# EAGLE design 1.0 (EAGLE 7.2.0)
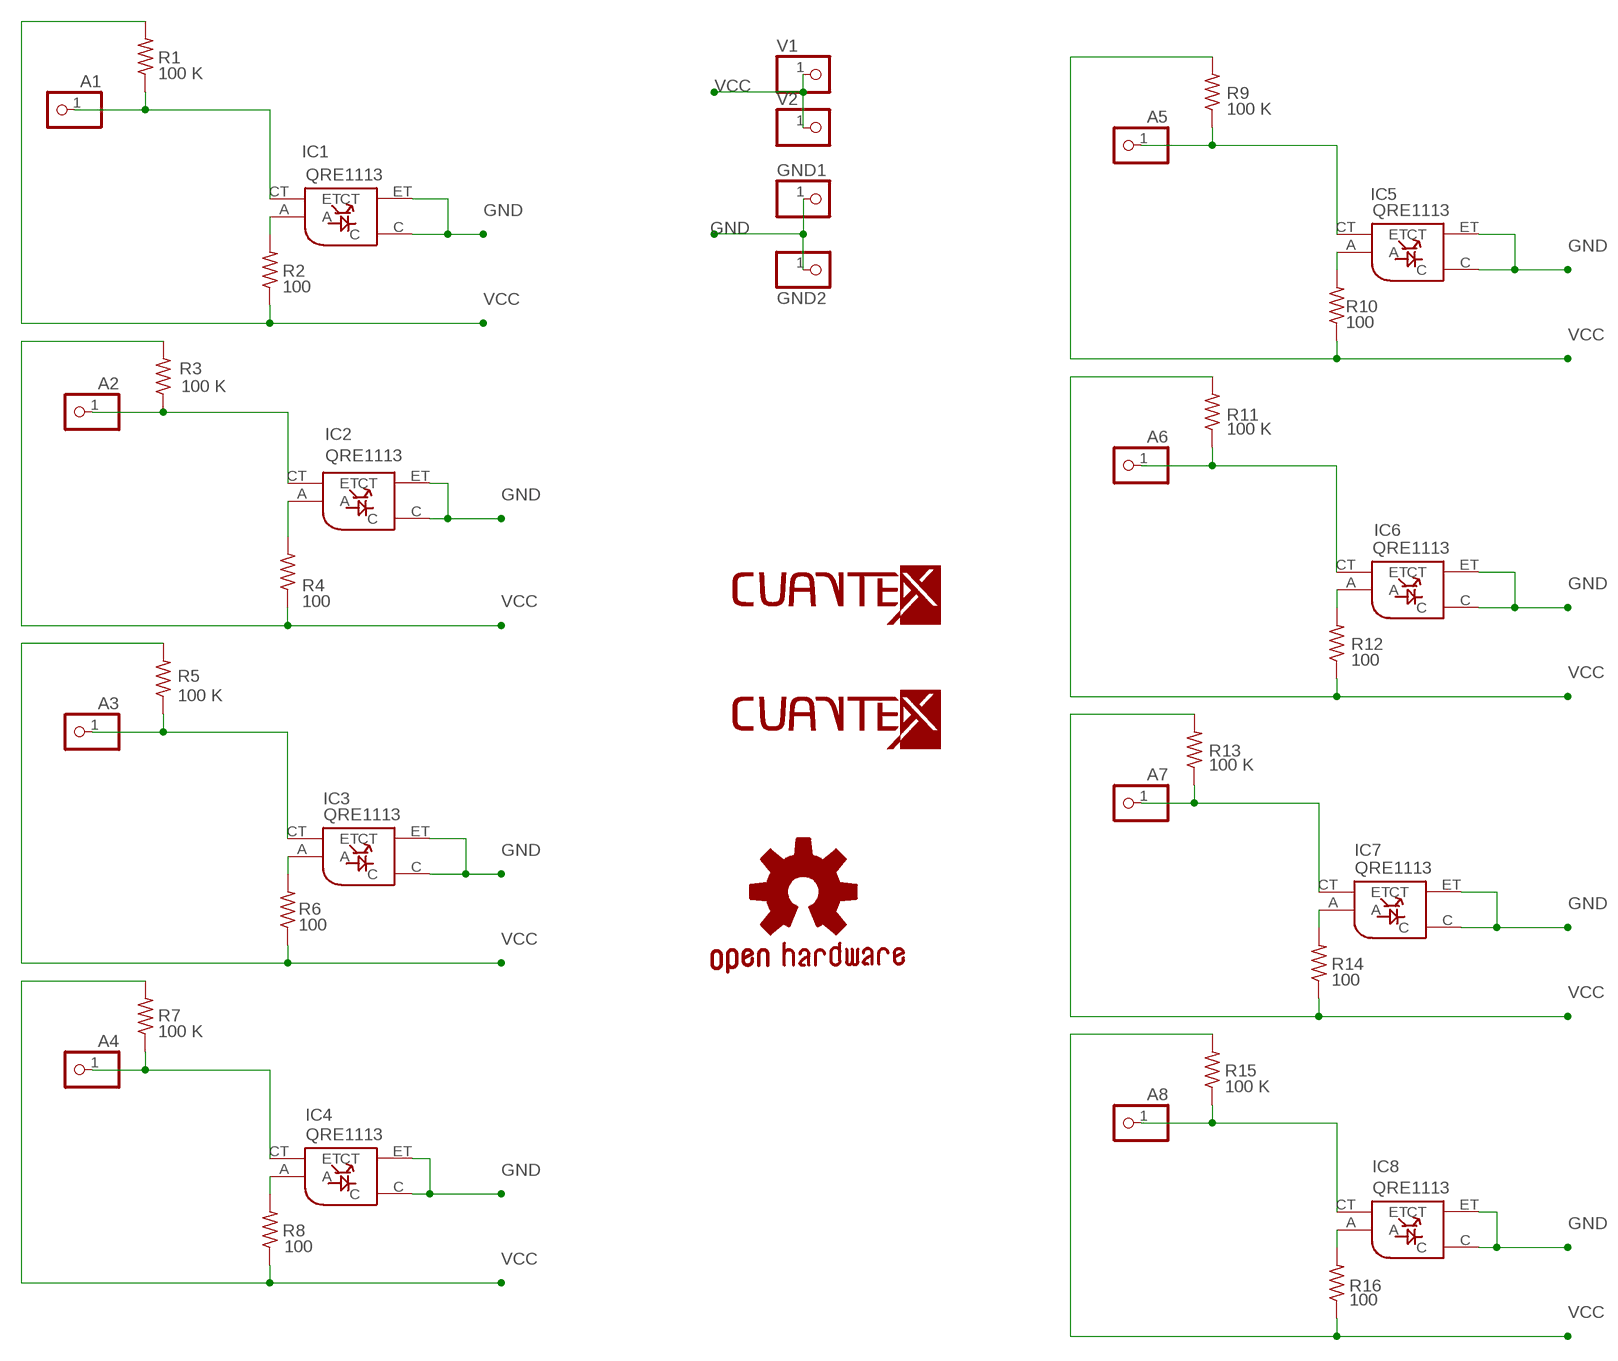
[diagram p0: schematic, sheet 1]

## Parts
A1  PINHD-1X1  [1X01]
A2  PINHD-1X1  [1X01]
A3  PINHD-1X1  [1X01]
A4  PINHD-1X1  [1X01]
A5  PINHD-1X1  [1X01]
A6  PINHD-1X1  [1X01]
A7  PINHD-1X1  [1X01]
A8  PINHD-1X1  [1X01]
GND1  PINHD-1X1  [1X01]
GND2  PINHD-1X1  [1X01]
GOLD_ORB_SM1  OSHWLOGO_GOLD_ORB_SM  [OSHW2]
IC1  QRE1113  [QRE1113]
IC2  QRE1113  [QRE1113]
IC3  QRE1113  [QRE1113]
IC4  QRE1113  [QRE1113]
IC5  QRE1113  [QRE1113]
IC6  QRE1113  [QRE1113]
IC7  QRE1113  [QRE1113]
IC8  QRE1113  [QRE1113]
R1  100 K  R-US_R0603  [R0603]
R2  100  R-US_R0603  [R0603]
R3  100 K  R-US_R0603  [R0603]
R4  100  R-US_R0603  [R0603]
R5  100 K  R-US_R0603  [R0603]
R6  100  R-US_R0603  [R0603]
R7  100 K  R-US_R0603  [R0603]
R8  100  R-US_R0603  [R0603]
R9  100 K  R-US_R0603  [R0603]
R10  100  R-US_R0603  [R0603]
R11  100 K  R-US_R0603  [R0603]
R12  100  R-US_R0603  [R0603]
R13  100 K  R-US_R0603  [R0603]
R14  100  R-US_R0603  [R0603]
R15  100 K  R-US_R0603  [R0603]
R16  100  R-US_R0603  [R0603]
U$1  LOGO-TOP-30MM  [C-1]
U$2  LOGO-TOP-20MM  [C-0]
V1  PINHD-1X1  [1X01]
V2  PINHD-1X1  [1X01]

## Nets
GND: GND1.1 GND2.1 IC1.C IC1.ET(CT) IC2.C IC2.ET(CT) IC3.C IC3.ET(CT) IC4.C IC4.ET(CT) IC5.C IC5.ET(CT) IC6.C IC6.ET(CT) IC7.C IC7.ET(CT) IC8.C IC8.ET(CT)
N$3: IC1.A R2.2
N$7: A1.1 IC1.CT(ET) R1.1
N$13: A2.1 IC2.CT(ET) R3.1
N$14: A5.1 IC5.CT(ET) R9.1
N$16: IC2.A R4.2
N$17: IC5.A R10.2
N$23: A3.1 IC3.CT(ET) R5.1
N$24: IC3.A R6.2
N$25: A6.1 IC6.CT(ET) R11.1
N$28: A4.1 IC4.CT(ET) R7.1
N$31: IC4.A R8.2
N$36: IC6.A R12.2
N$38: A8.1 IC8.CT(ET) R15.1
N$41: IC8.A R16.2
N$44: A7.1 IC7.CT(ET) R13.1
N$47: IC7.A R14.2
VCC: R1.2 R2.1 R3.2 R4.1 R5.2 R6.1 R7.2 R8.1 R9.2 R10.1 R11.2 R12.1 R13.2 R14.1 R15.2 R16.1 V1.1 V2.1

## Library data of the parts
A1-A8 GND1 GND2 V1 V2 = pinhead:PINHD-1X1: PIN HEADER
GOLD_ORB_SM1 = OPENHW:OSHWLOGO: These are Open-Source Hardware logos.
IC1-IC8 = qre1113:QRE1113
R1-R16 = resistor:R-US_: RESISTOR, American symbol
U$1 = LOGOTIPOS:LOGO-TOP-30MM
U$2 = LOGOTIPOS:LOGO-TOP-20MM

## Board
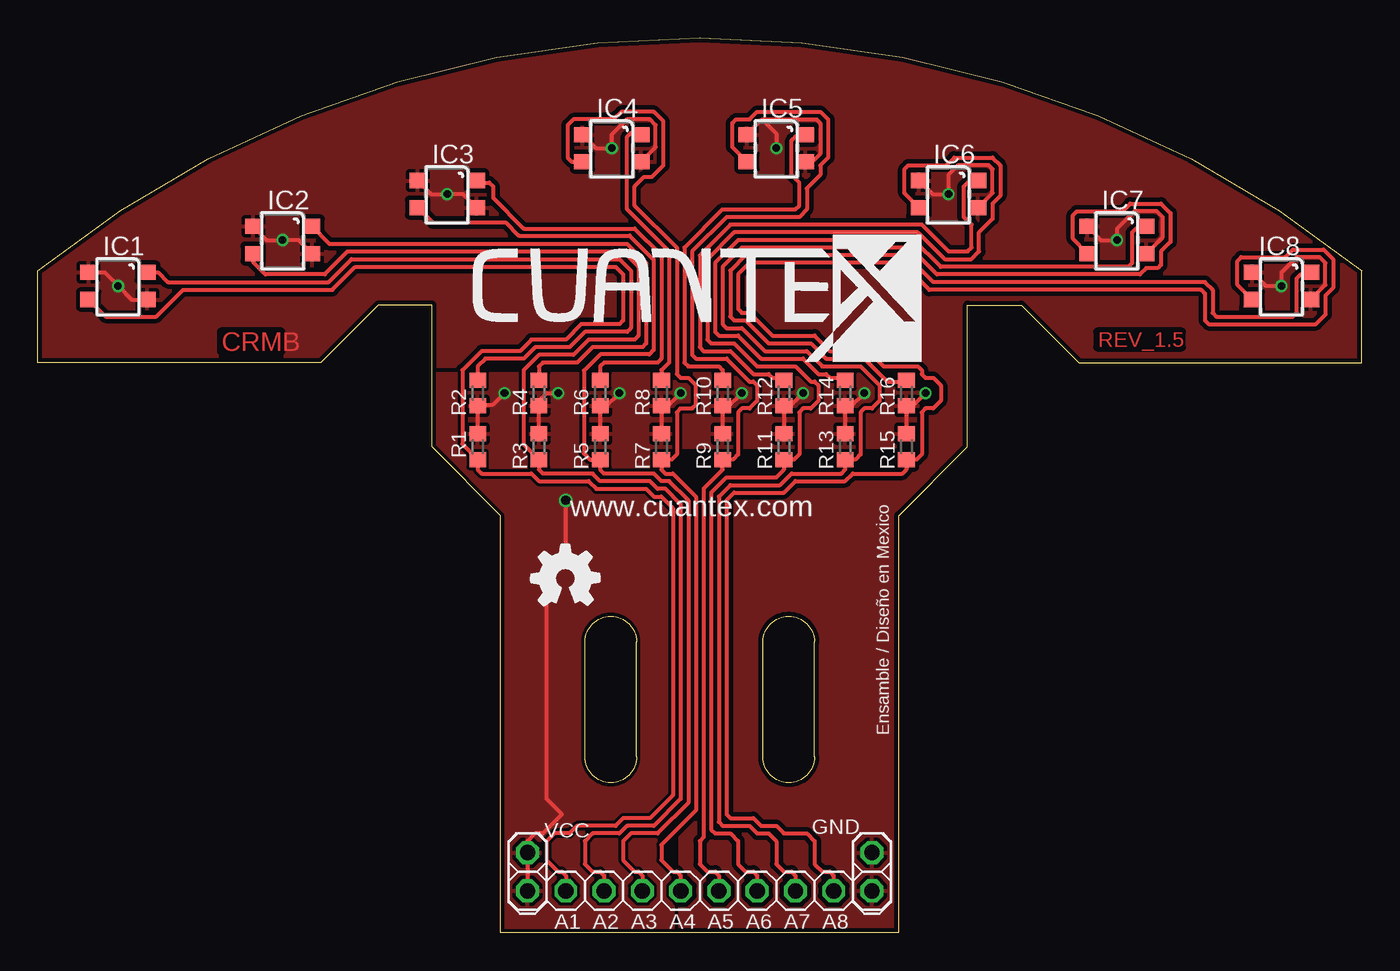
[diagram p1: board, top side]
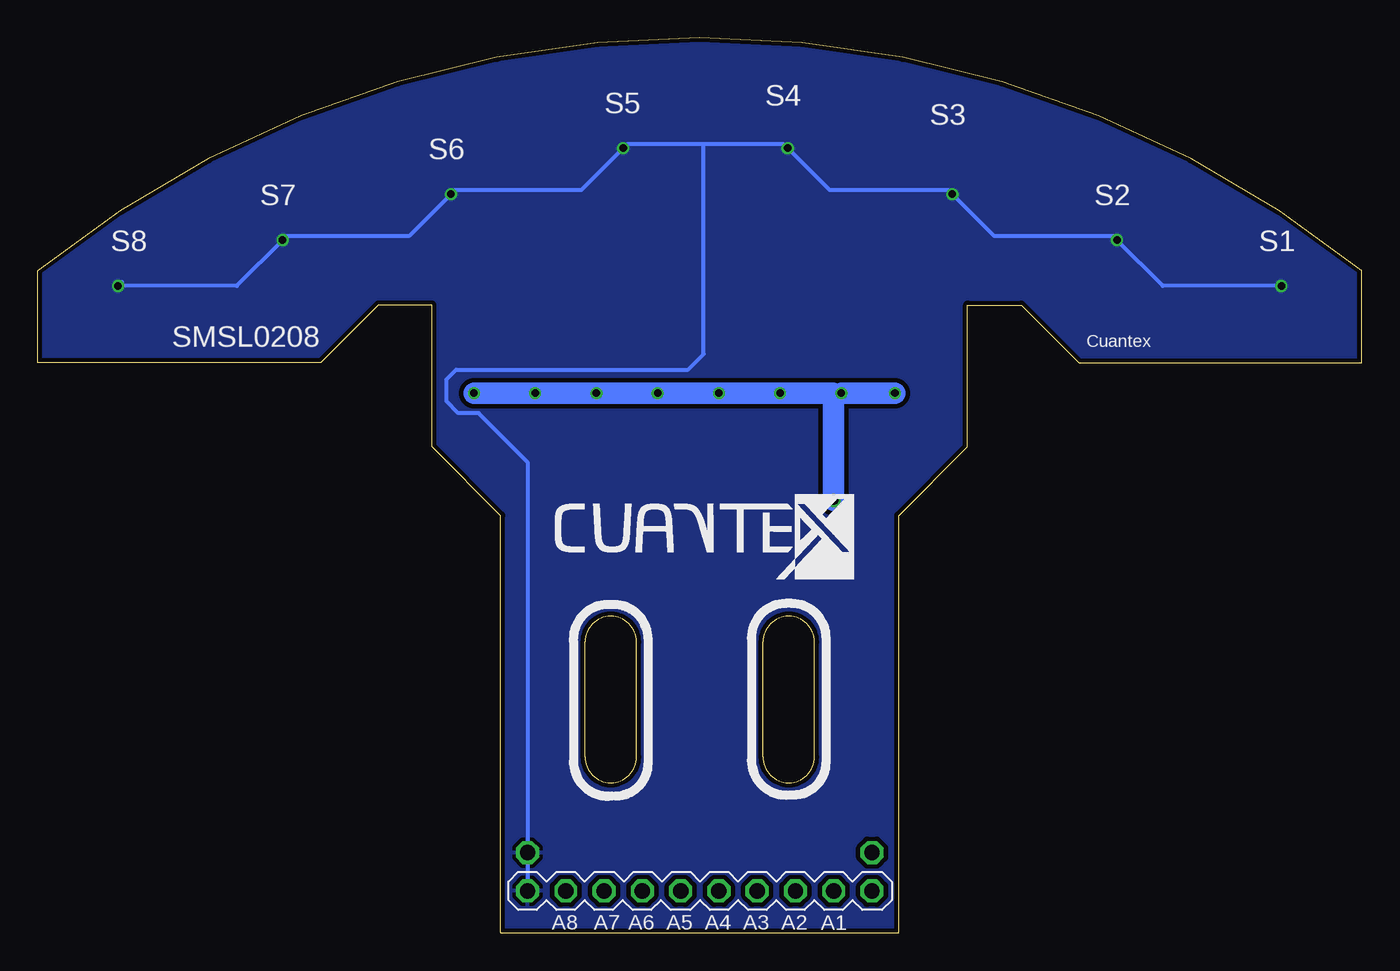
[diagram p2: board, bottom side, seen from below]

Size 87.88 x 59.4 mm. Coordinates in mm from the lower left corner, seen from the top.
Outline: 57.15,0 30.73,0 30.73,27.69 26.16,32.26 26.16,41.66 22.61,41.66 18.8,37.85 0,37.85 0,43.94 arc-78 87.88,43.94 87.88,37.85 69.09,37.85 65.28,41.66 61.72,41.66 61.72,32.26 57.15,27.69 57.15,0
Outline: 36.32,11.68 36.32,19.3 arc-180 39.75,19.3 39.75,11.68 arc-180 36.32,11.68
Outline: 48.13,11.68 48.13,19.3 arc-180 51.56,19.3 51.56,11.68 arc-180 48.13,11.68
Copper layers (1*16): Top 0.035mm / dielectric 1.5mm / Bottom 0.035mm
Design rules "DRC_HeTPpro_08_2014": minimum track width 8mil, minimum drill 12mil, track to track 8mil, track to pad 8mil, pad to pad 8mil, via to via 8mil, smd to smd 0mil, copper to edge 10mil, drill to drill 10mil, minimum pad ring 10mil, minimum via ring 6mil, stop-mask expansion 2mil, vias tented up to drill 100mil, thermal gap 10mil

### Footprints (pad centres in the part's own frame; a part is rotated, then mirrored left to right if it is on the bottom)
1X01 = drill 1.016 octagon: 1 0,0
QRE1113 = smd 1.1 x 1: A 1.95,0.9; C -1.95,0.9; CT -1.95,-0.9; ET 1.95,-0.9
R0603 = smd 1 x 1.1: 1 -0.85,0; 2 0.85,0

### Placement (x,y rotation side)
A1  35.05,2.79 0 top
A2  37.59,2.79 0 top
A3  40.13,2.79 0 top
A4  42.67,2.79 0 top
A5  45.21,2.79 0 top
A6  47.75,2.79 0 top
A7  50.29,2.79 0 top
A8  52.83,2.79 0 top
GND1  55.37,5.33 0 top
GND2  55.37,2.79 0 top
GOLD_ORB_SM1  31.2,19.24 0 top
IC1  5.33,42.93 0 top
IC2  16.26,45.97 0 top
IC3  27.18,49.02 0 top
IC4  38.1,52.07 0 top
IC5  49.02,52.07 0 top
IC6  60.45,49.02 0 top
IC7  71.63,45.97 0 top
IC8  82.55,42.93 0 top
R1  29.21,32.26 90 top
R2  29.21,35.81 90 top
R3  33.27,32.26 90 top
R4  33.27,35.81 90 top
R5  37.34,32.26 90 top
R6  37.34,35.81 90 top
R7  41.4,32.26 90 top
R8  41.4,35.81 90 top
R9  45.47,32.26 90 top
R10  45.47,35.81 90 top
R11  49.53,32.26 90 top
R12  49.53,35.81 90 top
R13  53.59,32.26 90 top
R14  53.59,35.81 90 top
R15  57.66,32.26 90 top
R16  57.66,35.81 90 top
U$1  28.81,37.81 0 top
U$2  53.6,23.43 0 bottom
V1  32.51,5.33 0 top
V2  32.51,2.79 0 top

### Tracks (layer width: path | path; a pad name or v marks a point on that pad's centre or on a via)
GND  (via drill 0.5)
  Top 0.254: 3.27,43.94 IC1.C 4.43,43.83 v5.33,42.93 6.23,42.03 IC1.ET | IC2.C 15.21,45.97 v16.26,45.97 17.31,45.97 IC2.ET | IC3.C 26.13,49.02 v27.18,49.02 28.23,49.02 IC3.ET | IC4.C 37.05,52.07 v38.1,52.07 38.1,52.96 39.12,53.97 40.64,53.97 41.02,53.59 41.02,52.14 IC4.ET | IC5.C 48.08,53.97 | 48.08,53.97 51.69,53.97 51.94,53.72 51.94,51.69 51.42,51.17 IC5.ET | 48.08,53.97 49.02,53.03 v49.02,52.07 | IC6.C 59.4,49.02 v60.45,49.02 60.45,50.29 61.09,50.93 63.12,50.93 63.37,50.67 63.37,49.09 IC6.ET | IC7.C 70.58,45.97 v71.63,45.97 71.63,46.74 72.77,47.88 74.3,47.88 74.68,47.5 74.68,46.17 IC7.ET | IC8.C 81.5,42.93 v82.55,42.93 82.55,43.81 83.57,44.83 85.09,44.83 85.47,44.45 85.47,43 IC8.ET
  Bottom 0.254: 82.3,43.18 v82.55,42.93 74.68,42.93 v71.63,45.97 71.37,46.23 63.25,46.23 v60.45,49.02 60.2,49.28 51.82,49.28 v49.02,52.07 48.77,52.32 43.69,52.32 | v5.33,42.93 13.21,42.93 v16.26,45.97 16.51,46.23 24.38,46.23 v27.18,49.02 27.43,49.28 35.31,49.28 v38.1,52.07 38.35,52.32 43.69,52.32 | 43.69,52.32 43.69,38.41 44.71,37.38 60.11,37.38 60.76,36.73 60.76,35.28 59.97,34.49 58.62,34.49 55.37,31.24 GND1.1 GND2.1
  pour Top (isolate 0.305): 42.67,0 42.67,31.75 57.15,31.75 58.93,33.53 58.93,36.32 57.66,37.59 26.16,37.59 26.16,41.66 22.61,41.66 18.8,37.85 0,37.85 0,43.94 2.03,45.47 4.57,47.24 7.62,49.28 11.68,51.56 15.49,53.34 19.3,54.86 22.86,56.13 26.42,57.15 29.72,57.91 32.51,58.42 35.81,58.93 38.86,59.18 43.43,59.44 50.04,59.18 55.63,58.42 60.45,57.4 63.5,56.64 67.31,55.37 70.36,54.1 73.66,52.83 76.96,51.05 79.25,49.78 81.03,48.77 85.6,45.72 87.88,43.94 87.88,37.85 69.09,37.85 65.28,41.66 61.72,41.66 61.72,32.26 57.15,27.69 57.15,0
  pour Bottom (isolate 0.305): 30.76,0.01 57.15,0.01 57.15,27.69 61.7,32.25 61.7,41.64 65.24,41.64 69.07,37.81 87.86,37.81 87.86,43.96 84.9,46.2 81.29,48.73 77.82,50.68 74.35,52.41 69.94,54.44 65.82,55.88 60.54,57.4 57.29,58.12 52.3,58.92 49.2,59.21 46.67,59.35 43.27,59.42 38.35,59.21 35.17,58.85 32.21,58.41 28.81,57.76 25.2,56.89 22.81,56.1 20.72,55.45 18.62,54.65 15.59,53.42 12.77,52.05 9.44,50.39 7.42,49.16 4.82,47.5 1.93,45.4 0.26,44.17 -0.02,43.88 -0.02,37.89 18.84,37.89 22.6,41.64 26.14,41.64 26.14,32.25 30.76,27.62
N$3
  Top 0.254: IC1.A 7.99,43.83 8.64,43.18 19.3,43.18 20.83,44.7 38.61,44.7 39.37,43.94 39.37,40.13 39.12,39.88 36.32,39.88 35.31,38.86 33.02,38.86 32.26,38.1 29.72,38.1 29.21,37.59 R2.2
N$7
  Top 0.254: A1.1 35.05,3.81 34.8,4.06 34.54,4.06 33.78,4.83 33.78,6.1 34.29,6.6 35.31,6.6 35.81,7.11 38.35,7.11 38.86,7.62 40.64,7.62 42.16,9.14 42.16,28.19 41.4,28.96 40.89,28.96 40.39,29.46 37.08,29.46 36.58,29.97 33.27,29.97 32.77,30.48 29.46,30.48 29.21,30.73 R1.1 28.19,32.42 28.19,37.34 29.46,38.61 32,38.61 32.77,39.37 35.05,39.37 36.07,40.39 38.61,40.39 38.86,40.64 38.86,43.69 38.35,44.2 21.08,44.2 19.56,42.67 9.65,42.67 7.87,40.89 4.52,40.89 IC1.CT
N$13
  Top 0.254: A2.1 37.59,3.81 37.34,4.06 36.83,4.06 36.32,4.57 36.32,6.1 36.83,6.6 38.61,6.6 39.12,7.11 40.89,7.11 42.67,8.89 42.67,28.45 41.66,29.46 41.15,29.46 40.64,29.97 37.34,29.97 36.83,30.48 33.53,30.48 33.27,30.73 R3.1 32.26,32.42 32.26,37.34 33.27,38.35 35.56,38.35 36.58,39.37 39.62,39.37 39.88,39.62 39.88,44.2 38.86,45.21 20.57,45.21 19.05,43.69 15.11,43.69 14.31,44.49 IC2.CT
N$14
  Top 0.254: A5.1 45.21,3.81 44.96,4.06 44.45,4.06 43.94,4.57 43.94,6.1 44.2,6.35 44.2,29.46 45.47,30.73 R9.1 46.14,31.41 46.48,31.75 46.48,34.54 46.74,34.8 47.24,34.8 47.75,35.31 47.75,36.32 47.5,36.58 47.24,36.58 45.72,38.1 43.69,38.1 43.43,38.35 43.43,45.21 45.72,47.5 50.55,47.5 51.05,48.01 51.05,49.4 51.94,50.29 51.94,50.93 52.45,51.43 52.45,53.97 51.94,54.48 47.75,54.48 47.24,53.97 46.36,53.97 46.1,53.72 46.1,52.14 IC5.CT
N$16
  Top 0.254: R4.2 33.27,37.59 33.53,37.85 35.81,37.85 36.83,38.86 40.13,38.86 40.39,39.12 40.39,44.45 39.12,45.72 19.36,45.72 IC2.A
N$17
  Top 0.254: R10.2 45.47,37.34 45.21,37.59 43.18,37.59 42.93,37.85 42.93,45.47 45.47,48.01 50.29,48.01 50.55,48.26 50.55,49.78 50.04,50.29 50.04,52.58 50.29,52.83 50.83,52.83 IC5.A
N$23
  Top 0.254: A3.1 40.13,3.81 39.88,4.06 39.62,4.06 38.86,4.83 38.86,6.1 39.37,6.6 41.15,6.6 43.18,8.64 43.18,28.7 41.91,29.97 41.4,29.97 40.89,30.48 37.59,30.48 37.34,30.73 R5.1 36.66,31.41 36.26,31.81 36.26,37.31 37.34,38.39 40.6,38.39 40.88,38.68 40.88,44.68 39.29,46.27 31.92,46.27 31.05,47.14 26.21,47.14 IC3.CT
N$24
  Top 0.254: IC3.A 29.13,49.87 29.21,49.78 29.97,49.78 30.23,49.53 30.23,48.77 32.26,46.74 39.62,46.74 41.4,44.96 41.4,38.1 41.15,37.85 37.59,37.85 37.34,37.59 R6.2
N$25
  Top 0.254: IC6.CT 57.53,49.09 57.53,50.67 57.79,50.93 60.33,50.93 60.83,51.43 63.37,51.43 63.88,50.93 63.88,48.89 63.37,48.39 63.37,47.37 62.48,46.48 62.48,45.21 61.98,44.7 60.2,44.7 58.42,46.48 46.23,46.48 44.45,44.7 44.45,39.37 44.7,39.12 46.23,39.12 47.75,37.59 50.29,37.59 51.31,36.58 51.56,36.58 51.82,36.32 51.82,35.31 51.31,34.8 50.8,34.8 50.55,34.54 50.55,31.75 50.2,31.41 R11.1 49.53,30.73 49.02,30.23 45.72,30.23 44.7,29.21 44.7,6.86 44.96,6.6 45.97,6.6 46.48,6.1 46.48,4.57 46.99,4.06 47.5,4.06 47.75,3.81 A6.1
N$28
  Top 0.254: IC4.CT 35.44,51.17 35.18,51.43 35.18,53.59 35.56,53.97 38.23,53.97 38.74,54.48 40.89,54.48 41.53,53.85 41.53,50.93 40.77,50.16 40.26,50.16 39.62,49.53 39.62,48.26 42.42,45.47 42.42,37.08 42.67,36.83 43.18,36.83 43.69,36.32 43.69,35.05 43.43,34.8 42.67,34.8 42.42,34.54 42.42,31.75 42.08,31.41 R7.1 41.4,30.73 41.66,30.48 42.16,30.48 43.69,28.96 43.69,8.13 41.4,5.84 41.4,4.83 42.16,4.06 42.42,4.06 42.67,3.81 A4.1
N$31
  Top 0.254: R8.2 41.4,37.34 41.91,37.85 41.91,45.21 39.12,48.01 39.12,52.83 39.37,53.09 39.93,53.09 IC4.A
N$36
  Top 0.254: IC6.A 62.26,49.78 61.72,49.78 61.47,49.53 61.47,47.5 61.98,46.99 61.98,45.47 61.72,45.21 60.45,45.21 58.67,46.99 45.97,46.99 43.94,44.96 43.94,38.86 44.2,38.61 45.97,38.61 47.5,37.08 48.51,37.08 48.77,36.83 49.36,36.83 R12.2
N$38
  Top 0.254: IC8.CT 79.63,43 79.63,44.58 79.88,44.83 82.8,44.83 83.31,45.34 85.34,45.34 85.98,44.7 85.98,42.8 85.47,42.29 85.47,41.02 84.84,40.39 77.72,40.39 77.47,40.64 77.47,42.42 77.22,42.67 59.18,42.67 57.4,44.45 47.24,44.45 46.48,43.69 46.48,41.4 46.74,41.15 47.24,41.15 48.77,39.62 51.56,39.62 52.58,38.61 55.12,38.61 56.13,37.59 58.42,37.59 58.67,37.34 58.67,37.08 58.93,36.83 59.44,36.83 59.94,36.32 59.94,35.31 59.44,34.8 58.93,34.8 58.67,34.54 58.67,31.75 58.33,31.41 R15.1 57.66,30.73 57.4,30.48 54.1,30.48 53.59,29.97 50.29,29.97 49.53,29.21 46.23,29.21 45.72,28.7 45.72,7.87 45.97,7.62 47.5,7.62 48.01,7.11 49.02,7.11 49.53,6.6 51.05,6.6 51.56,6.1 51.56,4.57 52.07,4.06 52.58,4.06 52.83,3.81 A8.1
N$41
  Top 0.254: IC8.A 84.36,43.69 83.82,43.69 83.57,43.43 83.57,41.15 83.31,40.89 78.23,40.89 77.98,41.15 77.98,42.67 77.47,43.18 59.44,43.18 57.66,44.96 46.99,44.96 45.97,43.94 45.97,40.89 46.23,40.64 46.99,40.64 48.51,39.12 51.31,39.12 52.32,38.1 54.86,38.1 56.39,36.58 57.57,36.58 R16.2
N$44
  Top 0.254: IC7.CT 68.71,46.04 68.71,47.62 68.96,47.88 72.01,47.88 72.52,48.39 74.55,48.39 75.18,47.75 75.18,45.85 74.55,45.21 74.55,44.32 74.34,44.11 73.58,44.11 73.15,43.69 59.69,43.69 57.91,45.47 46.74,45.47 45.47,44.2 45.47,40.39 45.72,40.13 46.74,40.13 48.26,38.61 51.05,38.61 52.07,37.59 54.61,37.59 55.88,36.32 55.88,35.31 55.37,34.8 54.86,34.8 54.61,34.54 54.61,31.75 54.27,31.41 R13.1 53.59,30.73 53.34,30.48 50.04,30.48 49.28,29.72 45.97,29.72 45.21,28.96 45.21,7.37 45.47,7.11 47.24,7.11 47.75,6.6 48.51,6.6 49.02,6.1 49.02,4.57 49.53,4.06 50.04,4.06 50.29,3.81 A7.1
N$47
  Top 0.254: 53.34,36.92 53.43,36.83 | IC7.A 73.44,46.74 72.9,46.74 72.64,46.48 72.64,44.45 72.39,44.2 59.94,44.2 58.17,45.97 46.48,45.97 44.96,44.45 44.96,39.88 45.21,39.62 46.48,39.62 48.01,38.1 50.8,38.1 51.82,37.08 52.32,37.08 52.58,36.83 53.43,36.83 | 53.43,36.83 R14.2
VCC  (via drill 0.5, 0.6)
  Top 0.254: R15.2 R16.1 58.08,34.96 v58.93,35.81 | v38.61,35.81 37.76,34.96 R6.1 R5.2 | v42.67,35.81 41.82,34.96 R8.1 R7.2 | v46.74,35.81 45.89,34.96 R10.1 R9.2 | v50.8,35.81 49.95,34.96 R12.1 R11.2 | v54.86,35.81 54.01,34.96 R14.1 R13.2 | 34.12,35.81 v34.54,35.81 33.78,35.81 33.27,35.31 R4.1 R3.2 | V2.1 V1.1 32.51,6.1 33.02,6.6 33.53,6.6 34.8,7.87 33.78,8.89 33.78,24.13 35.05,25.4 v35.05,28.7 | R1.2 R2.1 29.3,35.05 30.23,35.05 v30.99,35.81
  Bottom 0.254: v34.54,35.81 35.05,35.81
  Bottom 1.422: v58.93,35.81 v54.86,35.81 v50.8,35.81 v46.74,35.81 v42.67,35.81 v38.61,35.81 35.05,35.81 v35.05,28.7 | v30.99,35.81 v34.54,35.81
  pour Top: 30.73,0 42.16,0 42.16,32.26 56.9,32.26 58.42,33.78 58.42,36.07 57.4,37.08 26.16,37.08 26.16,32.26 30.73,27.69

### Text on the board
Top: CRMB | REV_1.5
tNames: Ensamble / Diseño en Mexico | www.cuantex.com | GND | VCC | A1 | A2 | A3 | A4 | A5 | A6 | A7 | A8
bNames: S4 | S3 | S5 | S6 | S2 | S7 | S1 | S8 | Cuantex | SMSL0208 | A1 | A2 | A3 | A4 | A5 | A6 | A7 | A8